# EAGLE design opto-endstop (EAGLE 5.10)
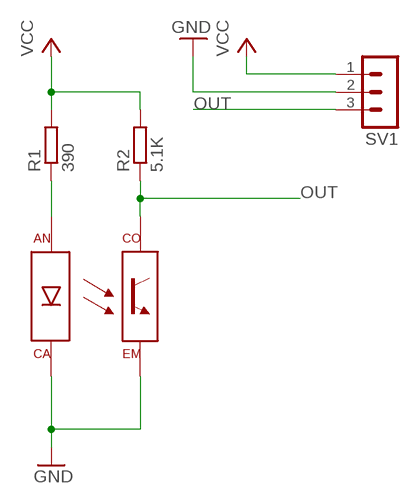
[diagram p0: schematic, sheet 1]

## Parts
R1  390  R-EU_0207/10  [0207/10]
R2  5.1K  R-EU_0207/10  [0207/10]
SV1  MA03-1  [MA03-1]
U$1  KTIR0521DS  [KTIR0521DS]

## Nets
GND: SV1.2 U$1.CA U$1.EM
N$2: R1.1 U$1.AN
OUT: R2.1 SV1.3 U$1.CO
VCC: R1.2 R2.2 SV1.1

## Library data of the parts
R1 R2 = rcl:R-EU_: RESISTOR, European symbol
SV1 = con-lstb:MA03-1: PIN HEADER
U$1 = local-lib:KTIR0521DS

## Board
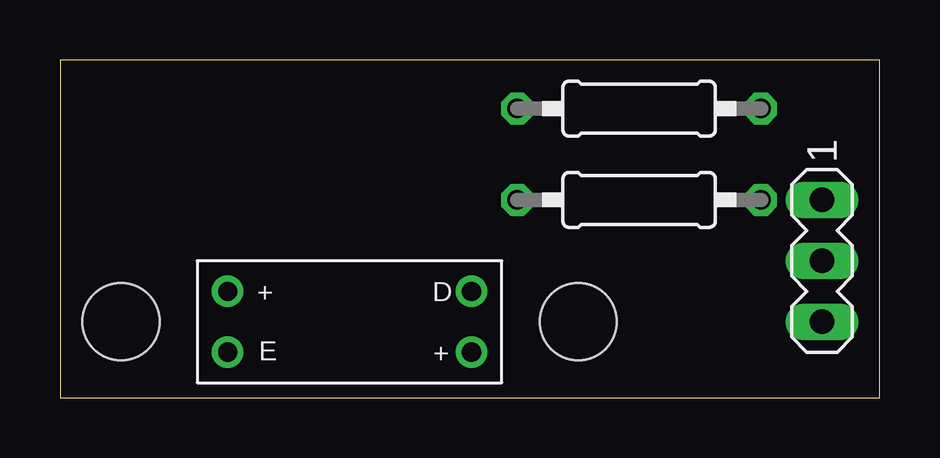
[diagram p1: board, top side]
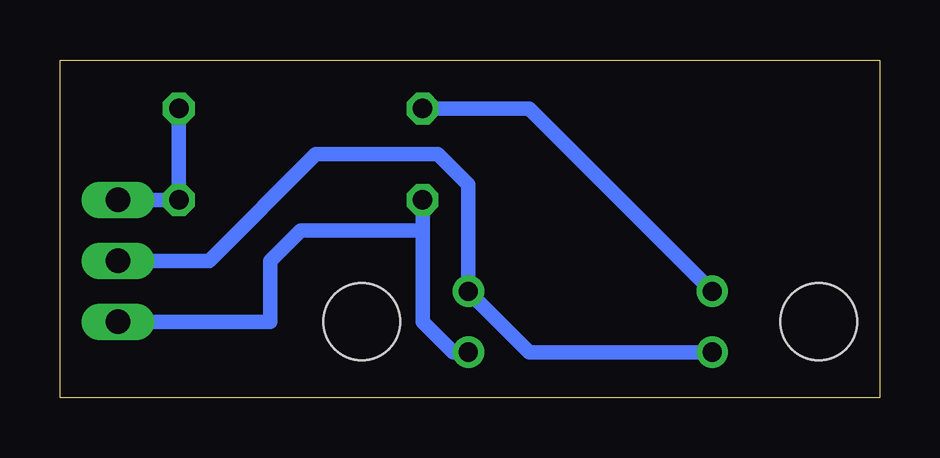
[diagram p2: board, bottom side, seen from below]

Size 34.16 x 14.1 mm. Coordinates in mm from the lower left corner, seen from the top.
Outline: 0,0 34.16,0 34.16,14.1 0,14.1 0,0
Copper layers (1*16): Top 0.018mm / dielectric 1.5mm / Bottom 0.018mm
Design rules "resonit_u18": minimum track width 0.15mm, minimum drill 0.6mm, track to track 0.15mm, track to pad 0.15mm, pad to pad 0.15mm, via to via 0.15mm, smd to smd 0.15mm, copper to edge 0.3mm, drill to drill 8mil, minimum pad ring 10mil, minimum via ring 8mil, stop-mask expansion 0.1mm, vias tented up to drill 0mil, thermal gap 10mil
Holes 3.2 mm at 2.54,3.17 21.59,3.17

### Footprints (pad centres in the part's own frame; a part is rotated, then mirrored left to right if it is on the bottom)
0207/10 = drill 0.813 octagon: 1 -5.08,0; 2 5.08,0
MA03-1 = drill 1.016 long: 1 -2.54,0; 2 0,0; 3 2.54,0
KTIR0521DS = drill 0.8 round: AN 1.27,3.81; CA 1.27,1.27; CO 11.43,1.27; EM 11.43,3.81

### Placement (x,y rotation side)
R1  24.13,12.06 0 top
R2  24.13,8.26 0 top
SV1  31.75,5.71 270 top
U$1  5.71,0.64 0 top

### Tracks (layer width: path | path; a pad name or v marks a point on that pad's centre or on a via)
GND
  Bottom 0.61: U$1.CA 14.61,1.91 U$1.EM 17.14,8.89 18.41,10.16 23.5,10.16 27.94,5.71 SV1.2
N$2
  Bottom 0.61: R1.1 14.61,12.06 U$1.AN
OUT
  Bottom 0.61: U$1.CO 17.78,1.91 19.05,3.17 19.05,6.98 | 19.05,6.98 R2.1 | SV1.3 25.4,3.17 25.4,5.71 24.13,6.98 19.05,6.98
VCC
  Bottom 0.61: SV1.1 R2.2 R1.2